# Altium schematic sheet MPPT.SchDoc
size A4; SheetNumber: 9; SheetTotal: 21
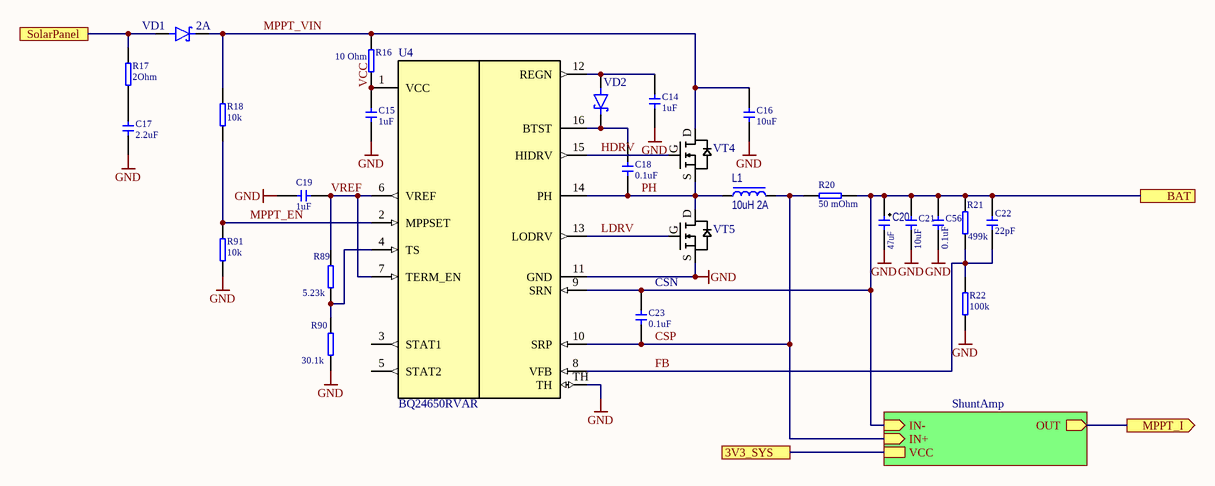
[diagram p0: MPPT.SchDoc]

## Parts
C14  value 1uF  [CERCAP 0402]
C15  value 1uF  [CERCAP 0402]
C16  value 10uF  [CERCAP 0603]
C17  value 2.2uF  [CERCAP 0603]
C18  value 0.1uF  [CERCAP 0402]
C19  value 1uF  [CERCAP 0402]
C20  value 47uF  [TECAP B]  (hidden comment: TAJC686K016RNJ)
C21  value 10uF  [CERCAP 0603]
C22  value 22pF  [CERCAP 0402]
C23  value 0.1uF  [CERCAP 0402]
C56  value 0.1uF  [CERCAP 0402]
L1  value 10uH 2A  [IND-4.6x4.6]
R16  value 10 Ohm  [RES 0402]
R17  value 2Ohm  [RES 0402]
R18  value 10k  [RES 0402]
R20  value 50 mOhm  [RES 1210]
R21  value 499k  [RES 0402]
R22  value 100k  [RES 0402]
R89  value 5.23k  [RES 0402]
R90  value 30.1k  [RES 0402]
R91  value 10k  [RES 0402]
U4  BQ24650RVAR  [QFN-16(3,5x3,5)]
VD1  (no value)  [SOD-123]
VD2  (no value)  [SOD-123]
VT4  NTMFS5C670NLT1G  [DFN-8_3x3]  (value not drawn)
VT5  NTMFS5C670NLT1G  [DFN-8_3x3]  (value not drawn)

## Sub-sheets
ShuntAmp = ShuntAmp.SchDoc: OUT (out), IN- (in), IN+ (in), VCC

## Ports
3V3_SYS, BAT, MPPT_I (out), SolarPanel

## Nets
GND: C14.1 C15.1 C16.2 C17.1 C19.2 C20.2(-) C21.1 C56.1 R22.1 R90.1 R91.1 U4.11(GND) U4.TH VT5.S1
3V3_SYS: port 3V3_SYS, sheet ShuntAmp/VCC
BAT: C20.1(+) C21.2 C22.2 C23.2 C56.2 R20.2 R21.2 U4.9(SRN) ; port BAT, sheet ShuntAmp/IN-
CSP: C23.1 L1.2 R20.1 U4.10(SRP) ; sheet ShuntAmp/IN+
FB: C22.1 R21.1 R22.2 U4.8(VFB)
HDRV: U4.15(HIDRV) VT4.G2
LDRV: U4.13(LODRV) VT5.G2
MPPT_EN: R18.1 R91.2 U4.2(MPPSET)
MPPT_I: port MPPT_I, sheet ShuntAmp/OUT
MPPT_VIN: C16.1 R16.2 R18.2 VD1.C(Cathode) VT4.D6
PH: C18.1 L1.1 U4.14(PH) VT4.S1 VT5.D6
SolarPanel: R17.2 VD1.A(Anode) ; port SolarPanel
VCC: C15.2 R16.1 U4.1(VCC)
VREF: C19.1 R89.2 U4.6(VREF) U4.7(TERM_EN)
NetC14_2: C14.2 U4.12(REGN) VD2.A(Anode)
NetC17_2: C17.2 R17.1
NetC18_2: C18.2 U4.16(BTST) VD2.C(Cathode)
NetR89_1: R89.1 R90.2 U4.4(TS)

Not connected (* = marked no-connect by the designer): U4 3(STAT1) 5(STAT2)

## Notes on the sheet
- (near VD1) 2A
- CSN
- (in symbol !Generic N MOSFET) D; G; S

## Library data of the parts
C14-C19 C21-C23 C56 = !Capacitor: Capacitor; IsSMT: NoSMT; Voltage: 50V; Diel: X7R
C20 = CapacitorP: Capacitor Polar; IsSMT: NoSMT; Diel: X7R; Voltage: *
L1 = Inductor: IsSMT: NoSMT
R16-R18 R20-R22 R89-R91 = !Resistor: Resistor; IsSMT: NoSMT
U4 = BQ24650RVAR: MPPT charger
VD1 VD2 = DiodeS: Diode Shottky; IsSMT: NoSMT
VT4 VT5 = !Generic N MOSFET: generic N mosfet; pin to pad: D6>5+6+7+8+TH G2>4 S1>1+2+3; IsSMT: NoSMT